# Altium schematic sheet Connector.SchDoc
size A3; SheetNumber: 8; SheetTotal: 9
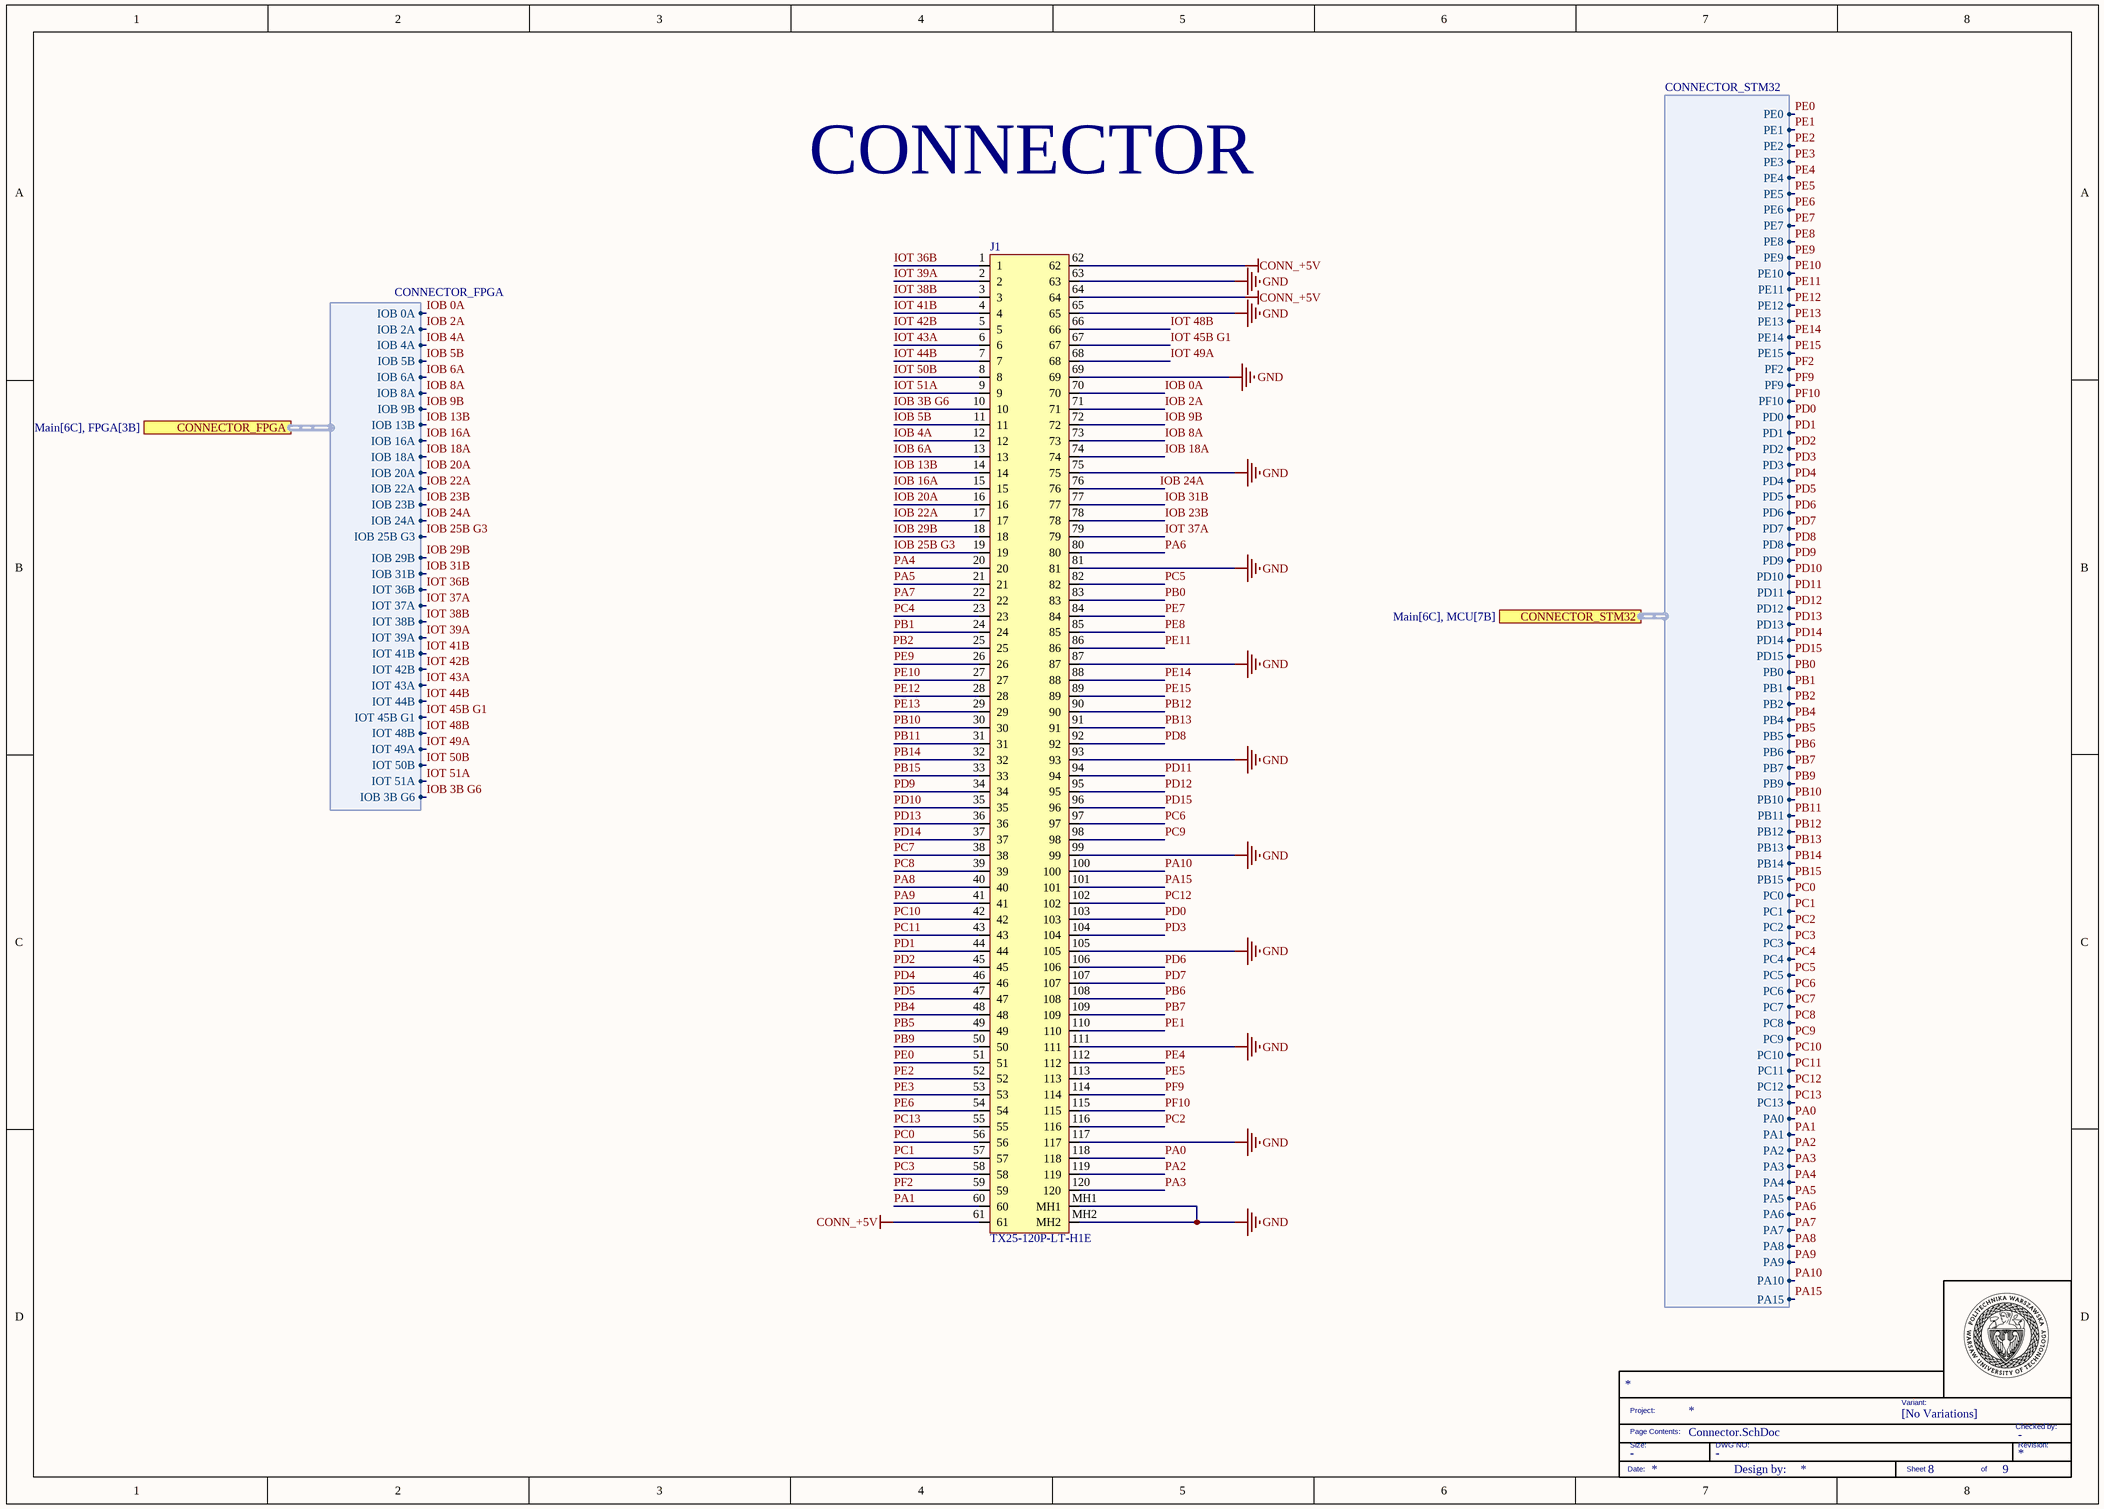
[diagram p0: Connector.SchDoc]

## Parts
*  TITLE_BLOCK  (value not drawn)  (graphical)
J1  TX25-120P-LT-H1E  [TX25120PLTH1E]

## Ports
CONNECTOR_FPGA (harness CONNECTOR_FPGA, see Main[6C], FPGA[3B]), CONNECTOR_STM32 (harness CONNECTOR_STM32, see Main[6C], MCU[7B])

## Harnesses
CONNECTOR_STM32: PE0, PE1, PE2, PE3, PE4, PE5, PE6, PE7, PE8, PE9, PE10, PE11, PE12, PE13, PE14, PE15, PF2, PF9, PF10, PD0, PD1, PD2, PD3, PD4, PD5, PD6, PD7, PD8, PD9, PD10, PD11, PD12, PD13, PD14, PD15, PB0, PB1, PB2, PB4, PB5, PB6, PB7, PB9, PB10, PB11, PB12, PB13, PB14, PB15, PC0, PC1, PC2, PC3, PC4, PC5, PC6, PC7, PC8, PC9, PC10, PC11, PC12, PC13, PA0, PA1, PA2, PA3, PA4, PA5, PA6, PA7, PA8, PA9, PA10, PA15
CONNECTOR_FPGA: IOB 0A, IOB 2A, IOB 4A, IOB 5B, IOB 6A, IOB 8A, IOB 9B, IOB 13B, IOB 16A, IOB 18A, IOB 20A, IOB 22A, IOB 23B, IOB 24A, IOB 25B G3, IOB 29B, IOB 31B, IOT 36B, IOT 37A, IOT 38B, IOT 39A, IOT 41B, IOT 42B, IOT 43A, IOT 44B, IOT 45B G1, IOT 48B, IOT 49A, IOT 50B, IOT 51A, IOB 3B G6

## Nets
CONN_+5V: J1.61 J1.62 J1.64
GND: J1.63 J1.65 J1.69 J1.75 J1.81 J1.87 J1.93 J1.99 J1.105 J1.111 J1.117 J1.MH1 J1.MH2
IOB 0A: J1.70 ; port CONNECTOR_FPGA.IOB 0A
IOB 2A: J1.71 ; port CONNECTOR_FPGA.IOB 2A
IOB 3B G6: J1.10 ; port CONNECTOR_FPGA.IOB 3B G6
IOB 4A: J1.12 ; port CONNECTOR_FPGA.IOB 4A
IOB 5B: J1.11 ; port CONNECTOR_FPGA.IOB 5B
IOB 6A: J1.13 ; port CONNECTOR_FPGA.IOB 6A
IOB 8A: J1.73 ; port CONNECTOR_FPGA.IOB 8A
IOB 9B: J1.72 ; port CONNECTOR_FPGA.IOB 9B
IOB 13B: J1.14 ; port CONNECTOR_FPGA.IOB 13B
IOB 16A: J1.15 ; port CONNECTOR_FPGA.IOB 16A
IOB 18A: J1.74 ; port CONNECTOR_FPGA.IOB 18A
IOB 20A: J1.16 ; port CONNECTOR_FPGA.IOB 20A
IOB 22A: J1.17 ; port CONNECTOR_FPGA.IOB 22A
IOB 23B: J1.78 ; port CONNECTOR_FPGA.IOB 23B
IOB 24A: J1.76 ; port CONNECTOR_FPGA.IOB 24A
IOB 25B G3: J1.19 ; port CONNECTOR_FPGA.IOB 25B G3
IOB 29B: J1.18 ; port CONNECTOR_FPGA.IOB 29B
IOB 31B: J1.77 ; port CONNECTOR_FPGA.IOB 31B
IOT 36B: J1.1 ; port CONNECTOR_FPGA.IOT 36B
IOT 37A: J1.79 ; port CONNECTOR_FPGA.IOT 37A
IOT 38B: J1.3 ; port CONNECTOR_FPGA.IOT 38B
IOT 39A: J1.2 ; port CONNECTOR_FPGA.IOT 39A
IOT 41B: J1.4 ; port CONNECTOR_FPGA.IOT 41B
IOT 42B: J1.5 ; port CONNECTOR_FPGA.IOT 42B
IOT 43A: J1.6 ; port CONNECTOR_FPGA.IOT 43A
IOT 44B: J1.7 ; port CONNECTOR_FPGA.IOT 44B
IOT 45B G1: J1.67 ; port CONNECTOR_FPGA.IOT 45B G1
IOT 48B: J1.66 ; port CONNECTOR_FPGA.IOT 48B
IOT 49A: J1.68 ; port CONNECTOR_FPGA.IOT 49A
IOT 50B: J1.8 ; port CONNECTOR_FPGA.IOT 50B
IOT 51A: J1.9 ; port CONNECTOR_FPGA.IOT 51A
PA0: J1.118 ; port CONNECTOR_STM32.PA0
PA1: J1.60 ; port CONNECTOR_STM32.PA1
PA2: J1.119 ; port CONNECTOR_STM32.PA2
PA3: J1.120 ; port CONNECTOR_STM32.PA3
PA4: J1.20 ; port CONNECTOR_STM32.PA4
PA5: J1.21 ; port CONNECTOR_STM32.PA5
PA6: J1.80 ; port CONNECTOR_STM32.PA6
PA7: J1.22 ; port CONNECTOR_STM32.PA7
PA8: J1.40 ; port CONNECTOR_STM32.PA8
PA9: J1.41 ; port CONNECTOR_STM32.PA9
PA10: J1.100 ; port CONNECTOR_STM32.PA10
PA15: J1.101 ; port CONNECTOR_STM32.PA15
PB0: J1.83 ; port CONNECTOR_STM32.PB0
PB1: J1.24 ; port CONNECTOR_STM32.PB1
PB2: J1.25 ; port CONNECTOR_STM32.PB2
PB4: J1.48 ; port CONNECTOR_STM32.PB4
PB5: J1.49 ; port CONNECTOR_STM32.PB5
PB6: J1.108 ; port CONNECTOR_STM32.PB6
PB7: J1.109 ; port CONNECTOR_STM32.PB7
PB9: J1.50 ; port CONNECTOR_STM32.PB9
PB10: J1.30 ; port CONNECTOR_STM32.PB10
PB11: J1.31 ; port CONNECTOR_STM32.PB11
PB12: J1.90 ; port CONNECTOR_STM32.PB12
PB13: J1.91 ; port CONNECTOR_STM32.PB13
PB14: J1.32 ; port CONNECTOR_STM32.PB14
PB15: J1.33 ; port CONNECTOR_STM32.PB15
PC0: J1.56 ; port CONNECTOR_STM32.PC0
PC1: J1.57 ; port CONNECTOR_STM32.PC1
PC2: J1.116 ; port CONNECTOR_STM32.PC2
PC3: J1.58 ; port CONNECTOR_STM32.PC3
PC4: J1.23 ; port CONNECTOR_STM32.PC4
PC5: J1.82 ; port CONNECTOR_STM32.PC5
PC6: J1.97 ; port CONNECTOR_STM32.PC6
PC7: J1.38 ; port CONNECTOR_STM32.PC7
PC8: J1.39 ; port CONNECTOR_STM32.PC8
PC9: J1.98 ; port CONNECTOR_STM32.PC9
PC10: J1.42 ; port CONNECTOR_STM32.PC10
PC11: J1.43 ; port CONNECTOR_STM32.PC11
PC12: J1.102 ; port CONNECTOR_STM32.PC12
PC13: J1.55 ; port CONNECTOR_STM32.PC13
PD0: J1.103 ; port CONNECTOR_STM32.PD0
PD1: J1.44 ; port CONNECTOR_STM32.PD1
PD2: J1.45 ; port CONNECTOR_STM32.PD2
PD3: J1.104 ; port CONNECTOR_STM32.PD3
PD4: J1.46 ; port CONNECTOR_STM32.PD4
PD5: J1.47 ; port CONNECTOR_STM32.PD5
PD6: J1.106 ; port CONNECTOR_STM32.PD6
PD7: J1.107 ; port CONNECTOR_STM32.PD7
PD8: J1.92 ; port CONNECTOR_STM32.PD8
PD9: J1.34 ; port CONNECTOR_STM32.PD9
PD10: J1.35 ; port CONNECTOR_STM32.PD10
PD11: J1.94 ; port CONNECTOR_STM32.PD11
PD12: J1.95 ; port CONNECTOR_STM32.PD12
PD13: J1.36 ; port CONNECTOR_STM32.PD13
PD14: J1.37 ; port CONNECTOR_STM32.PD14
PD15: J1.96 ; port CONNECTOR_STM32.PD15
PE0: J1.51 ; port CONNECTOR_STM32.PE0
PE1: J1.110 ; port CONNECTOR_STM32.PE1
PE2: J1.52 ; port CONNECTOR_STM32.PE2
PE3: J1.53 ; port CONNECTOR_STM32.PE3
PE4: J1.112 ; port CONNECTOR_STM32.PE4
PE5: J1.113 ; port CONNECTOR_STM32.PE5
PE6: J1.54 ; port CONNECTOR_STM32.PE6
PE7: J1.84 ; port CONNECTOR_STM32.PE7
PE8: J1.85 ; port CONNECTOR_STM32.PE8
PE9: J1.26 ; port CONNECTOR_STM32.PE9
PE10: J1.27 ; port CONNECTOR_STM32.PE10
PE11: J1.86 ; port CONNECTOR_STM32.PE11
PE12: J1.28 ; port CONNECTOR_STM32.PE12
PE13: J1.29 ; port CONNECTOR_STM32.PE13
PE14: J1.88 ; port CONNECTOR_STM32.PE14
PE15: J1.89 ; port CONNECTOR_STM32.PE15
PF2: J1.59 ; port CONNECTOR_STM32.PF2
PF9: J1.114 ; port CONNECTOR_STM32.PF9
PF10: J1.115 ; port CONNECTOR_STM32.PF10

## Notes on the sheet
- CONNECTOR
- (in symbol CMP-003-000005-7) Variant:; Project:; [No Variations]; Checked by:; Page Contents:; Size:; DWG NO:; Revision:; Date:; Design by:; Sheet; of

## Library data of the parts
* = CMP-003-000005-7: TITLEBLOCK; DWG NO: -; Size: -; Checked by: -; Design Item ID: TITLE_BLOCK; Source: TITLEBLOCK.SchLib
J1 = CMP-002-00072-7: Board-to-Board Connector; Manufacturer_Name: JAE; Connector Type: BOARD STACKING CONNECTOR; Design Item ID: TX25-120P-LT-H1E; Mounting Technology: Board; Height: 9.2mm; Manufacturer_Part_Number: TX25-120P-LT-H1E; Source: SamacSys.SchLib; Mouser Part Number: 656-TX25120PLTH1E; Datasheet Link: https://www.jae.com/direct/topics/topics_file_download/topics_id=66775&ext_no=06&_lang=en&v=; Mouser Price/Stock: https://www.mouser.co.uk/ProductDetail/JAE-Electronics/TX25-120P-LT-H1E?qs=X2uUhIUKvwIqaiFkkBAxfw%3D%3D; Min Operating Temperature: -40°C; RoHS Compliant: Yes; Max Operating Temperature: 80°C